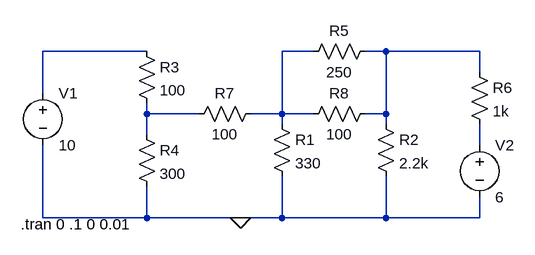
[diagram p0: schematic MALLA.asc]
MALLA.asc, the LTspice schematic file:
Version 4
SHEET 1 880 680
WIRE -544 -176 -704 -176
WIRE -288 -176 -336 -176
WIRE -176 -176 -208 -176
WIRE -32 -176 -176 -176
WIRE -32 -144 -32 -176
WIRE -704 -112 -704 -176
WIRE -544 -80 -544 -96
WIRE -464 -80 -544 -80
WIRE -336 -80 -336 -176
WIRE -336 -80 -384 -80
WIRE -288 -80 -336 -80
WIRE -176 -80 -176 -176
WIRE -176 -80 -208 -80
WIRE -336 -64 -336 -80
WIRE -176 -64 -176 -80
WIRE -544 -48 -544 -80
WIRE -32 -32 -32 -64
WIRE -704 80 -704 -32
WIRE -544 80 -544 32
WIRE -544 80 -704 80
WIRE -400 80 -544 80
WIRE -336 80 -336 16
WIRE -336 80 -400 80
WIRE -176 80 -176 16
WIRE -176 80 -336 80
WIRE -32 80 -32 48
WIRE -32 80 -176 80
FLAG -400 80 0
SYMBOL res -352 -80 R0
SYMATTR InstName R1
SYMATTR Value 330
SYMBOL res -192 -80 R0
SYMATTR InstName R2
SYMATTR Value 2.2k
SYMBOL res -560 -192 R0
SYMATTR InstName R3
SYMATTR Value 100
SYMBOL res -560 -64 R0
SYMATTR InstName R4
SYMATTR Value 300
SYMBOL voltage -704 -128 R0
WINDOW 123 0 0 Left 0
WINDOW 39 0 0 Left 0
SYMATTR InstName V1
SYMATTR Value 10
SYMBOL res -192 -192 R90
WINDOW 0 0 56 VBottom 2
WINDOW 3 32 56 VTop 2
SYMATTR InstName R5
SYMATTR Value 250
SYMBOL res -48 -160 R0
SYMATTR InstName R6
SYMATTR Value 1k
SYMBOL res -368 -96 R90
WINDOW 0 0 56 VBottom 2
WINDOW 3 32 56 VTop 2
SYMATTR InstName R7
SYMATTR Value 100
SYMBOL voltage -32 -48 R0
WINDOW 123 0 0 Left 0
WINDOW 39 0 0 Left 0
SYMATTR InstName V2
SYMATTR Value 6
SYMBOL res -192 -96 R90
WINDOW 0 0 56 VBottom 2
WINDOW 3 32 56 VTop 2
SYMATTR InstName R8
SYMATTR Value 100
TEXT -738 90 Left 2 !.tran 0 .1 0 0.01

The netlist it stands for:
* MALLA.asc
R1 N002 0 330
R2 N003 0 2.2k
R3 N001 N004 100
R4 N004 0 300
V1 N001 0 10
R5 N003 N002 250
R6 N003 N005 1k
R7 N002 N004 100
V2 N005 0 6
R8 N003 N002 100
.tran 0 .1 0 0.01
.backanno
.end